# Altium schematic sheet sch_power.SchDoc
size A4
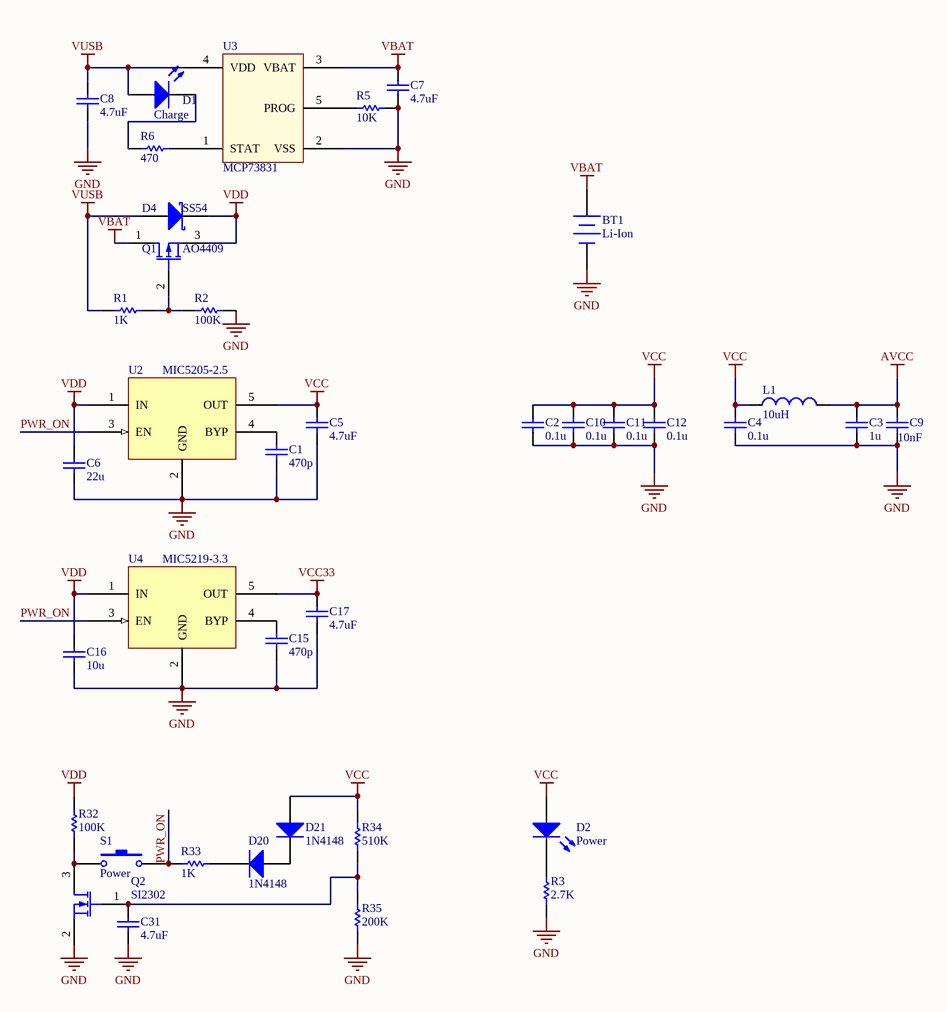
[diagram p0: sch_power.SchDoc]

## Parts
BT1  Li-Ion  [HDR1X2]
C1  value 470p  [C-1608[0603]]  (hidden comment: Cap Semi)
C2  value 0.1u  [C-1608[0603]]  (hidden comment: Cap Semi)
C3  value 1u  [C-1608[0603]]  (hidden comment: Cap Semi)
C4  value 0.1u  [C-1608[0603]]  (hidden comment: Cap Semi)
C5  value 4.7uF  [C-1608[0603]]  (hidden comment: Cap Semi)
C6  value 22u  [C-2012[0805]]  (hidden comment: Cap Semi)
C7  value 4.7uF  [C-1608[0603]]  (hidden comment: Cap Semi)
C8  value 4.7uF  [C-1608[0603]]  (hidden comment: Cap Semi)
C9  value 10nF  [C-1608[0603]]  (hidden comment: Cap Semi)
C10  value 0.1u  [C-1608[0603]]  (hidden comment: Cap Semi)
C11  value 0.1u  [C-1608[0603]]  (hidden comment: Cap Semi)
C12  value 0.1u  [C-1608[0603]]  (hidden comment: Cap Semi)
C15  value 470p  [C-1608[0603]]  (hidden comment: Cap Semi)
C16  value 10u  [C-2012[0805]]  (hidden comment: Cap Semi)
C17  value 4.7uF  [C-1608[0603]]  (hidden comment: Cap Semi)
C31  value 4.7uF  [C-1608[0603]]  (hidden comment: Cap Semi)
D1  Charge  [LED-1608[0603]-R]
D2  Power  [LED-1608[0603]-G]
D4  SS54  [DO-214AA]
D20  1N4148  [SOD80C]
D21  1N4148  [SOD80C]
L1  value 10uH  [L-1608[0603]]  (hidden comment: Inductor)
Q1  AO4409  [SOP8-MOS]
Q2  SI2302  [SOT23B]
R1  value 1K  [R-1608[0603]]  (hidden comment: Res Semi)
R2  value 100K  [R-1608[0603]]  (hidden comment: Res Semi)
R3  value 2.7K  [R-1608[0603]]  (hidden comment: Res Semi)
R5  value 10K  [R-1608[0603]]  (hidden comment: Res Semi)
R6  value 470  [R-1608[0603]]  (hidden comment: Res Semi)
R32  value 100K  [R-1608[0603]]  (hidden comment: Res Semi)
R33  value 1K  [R-1608[0603]]  (hidden comment: Res Semi)
R34  value 510K  [R-1608[0603]]  (hidden comment: Res Semi)
R35  value 200K  [R-1608[0603]]  (hidden comment: Res Semi)
S1  Power  [TS-015]
U2  MIC5205-2.5  [SOT23-5]
U3  MCP73831  [SOT23-5]
U4  MIC5219-3.3  [SOT23-5]

## Nets
AVCC: C3.2 C9.2 L1.2
GND: BT1.2(-) C1.2 C2.1 C3.1 C4.1 C5.2 C6.2 C7.1 C8.1 C9.1 C10.1 C11.1 C12.1 C15.2 C16.2 C17.2 C31.1 Q2.2(S) R2.2 R3.2 R5.1 R35.1 U2.2(GND) U3.2(VSS) U4.2(GND)
VBAT: BT1.1(+) C7.2 Q1.1(D) U3.3(VBAT)
VCC: C2.2 C4.2 C5.1 C10.2 C11.2 C12.2 D2.1(A) D21.1(A) L1.1 R34.2 U2.5(OUT)
VCC33: C17.1 U4.5(OUT)
VDD: C6.1 C16.1 D4.2(K) Q1.3(S) R32.2 U2.1(IN) U4.1(IN)
VUSB: C8.2 D1.1(A) D4.1(A) R1.1 U3.4(VDD)
PWR_ON: R33.2 S1.2 U2.3(EN) U4.3(EN)
NetC1_1: C1.1 U2.4(BYP)
NetC15_1: C15.1 U4.4(BYP)
NetC31_2: C31.2 Q2.1(G) R34.1 R35.2
NetD1_2: D1.2(K) R6.1
NetD2_2: D2.2(K) R3.1
NetD20_1: D20.1(A) D21.2(K)
NetD20_2: D20.2(K) R33.1
NetQ1_2: Q1.2(G) R1.2 R2.1
NetQ2_3: Q2.3(D) R32.1 S1.1
NetR5_2: R5.2 U3.5(PROG)
NetR6_2: R6.2 U3.1(STAT)

## Library data of the parts
BT1 = Battery: Multicell Battery; Published: 24-Mar-1999; LatestRevisionDate: 17-Jul-2002; LatestRevisionNote: Re-released for DXP Platform.; PackageReference: BAT-2; Publisher: Altium Limited
C1-C12 C15-C17 C31 = Cap Semi: Capacitor (Semiconductor SIM Model); Published: 8-Jun-2000; PackageReference: C1206; Publisher: Altium Limited
  C1 C5 C6 C15-C17: LatestRevisionDate: 29-May-2009; LatestRevisionNote: IPC-7351 Footprint Added.; PackageDescription: Chip Capacitor
  C2-C4 C7-C12 C31: LatestRevisionDate: 17-Jul-2002; LatestRevisionNote: Re-released for DXP Platform.
D1 D2 = LED2: Typical RED, GREEN, YELLOW, AMBER GaAs LED; Published: 8-Jun-2000; LatestRevisionDate: 17-Jul-2002; LatestRevisionNote: Re-released for DXP Platform.; PackageDocument: Feb-2002; PackageReference: 3.2X1.6X1.1; Publisher: Altium Limited
D4 = D Schottky: Schottky Diode; Published: 8-Jun-2000; LatestRevisionDate: 17-Jul-2002; LatestRevisionNote: Re-released for DXP Platform.; Publisher: Altium Limited
D20 D21 = Diode 1N4148: High Conductance Fast Diode; Published: 8-Jun-2000; LatestRevisionDate: 17-Jul-2002; LatestRevisionNote: Re-released for DXP Platform.; DatasheetDocument: 1997; PackageReference: DO-35; Publisher: Altium Limited; Code_JEDEC: DO-204-AH; ComponentLink1Description: Manufacturer Link; ComponentLink1URL: http://www.fairchildsemi.com/; ComponentLink2Description: Datasheet; ComponentLink2URL: http://www.fairchildsemi.com/ds/1N%2F1N4148.pdf
L1 = Inductor: Code_IEC: 1005; Published: 8-Jun-2000; LatestRevisionDate: 17-Jul-2002; LatestRevisionNote: Re-released for DXP Platform.; PackageReference: 0402-A; Publisher: Altium Limited; Code_JEITA: 0402
Q1 = MOSFET-P: P-Channel MOSFET; pin to pad: 1>D 2>G 3>S; PackageDocument: 1995/1996; Published: 8-Jun-2000; LatestRevisionDate: 17-Jul-2002; LatestRevisionNote: Re-released for DXP Platform.; PackageReference: E3; Publisher: Altium Limited
Q2 = SI2302: N-Channel MOSFET; Published: 8-Jun-2000; LatestRevisionDate: 17-Jul-2002; LatestRevisionNote: Re-released for DXP Platform.; PackageVersion: 1995/1996; PackageReference: E3; Publisher: Altium Limited
R1-R3 R5 R6 R32-R35 = Res Semi: Semiconductor Resistor; Published: 8-Jun-2000; LatestRevisionDate: 17-Jul-2002; LatestRevisionNote: Re-released for DXP Platform.; PackageReference: AXIAL-0.5; Publisher: Altium Limited
  R3 R32-R35: PackageDescription: Axial Device, Thru-Hole; 2 Leads; 0.5 in Pin Spacing
S1 = SW-PB: Switch; Published: 24-Mar-1999; LatestRevisionDate: 17-Jul-2002; LatestRevisionNote: Re-released for DXP Platform.; PackageReference: SPST-2; Publisher: Altium Limited
U2 U4 = MIC5219: 500mA-Peak Output LDO Regulator
U3 = MCP73831: Miniature Single-Cell, Fully Integrated Li-Ion, Li-Polymer Charge Management Controllers